# Altium schematic sheet Power.SchDoc
size A; SheetNumber: 3; SheetTotal: 3
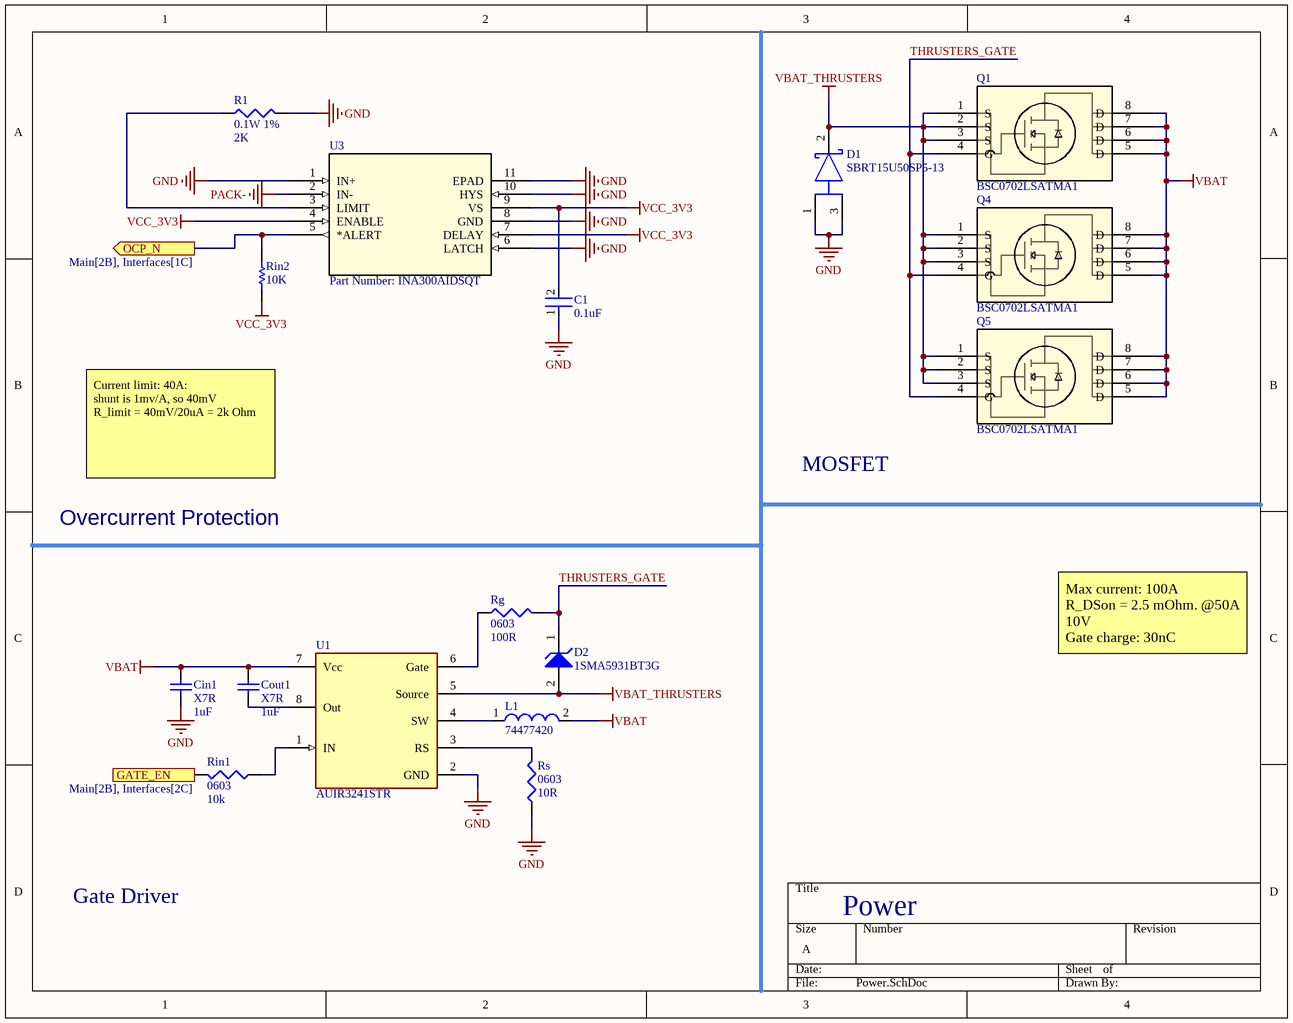
[diagram p0: Power.SchDoc]

## Parts
C1  0.1uF  [FP-C0603C-CF-MFG]
Cin1  X7R  value 1uF  [C0805]
Cout1  X7R  value 1uF  [C0805]
D1  SBRT15U50SP5-13  [FP-PowerDI5-MFG]
D2  1SMA5931BT3G  [ONSC-SMA-2-403D-02_F_V]
L1  74477420  [WE-PD2-M]
Q1  BSC0702LSATMA1  [PG-TDSON-8-7]
Q4  BSC0702LSATMA1  [PG-TDSON-8-7]
Q5  BSC0702LSATMA1  [PG-TDSON-8-7]
R1  0.1W 1%  value 2K  [J1-0603]
Rg  0603  value 100R  [J1-0603]
Rin1  0603  value 10k  [J1-0603]
Rin2  10K  [RESC0603(1608)_N]
Rs  0603  value 10R  [J1-0603]
U1  AUIR3241STR  [FP-PG-DSO-8-MFG]
U3  Part Number: INA300AIDSQT  [DSQ10_P9X1P5]

## Ports
GATE_EN (in, see Main[2B], Interfaces[2C]), OCP_N (out, see Main[2B], Interfaces[1C])

## Nets
GND: C1.1 Cin1.1 D1.1(A) D1.3(A) R1.2 Rs.1 U1.2(GND) U3.1(IN+) U3.6(LATCH) U3.8(GND) U3.10(HYS) U3.11(EPAD)
PACK-: U3.2(IN-)
VBAT: Cin1.2 Cout1.2 L1.2 Q1.5(D) Q1.6(D) Q1.7(D) Q1.8(D) Q4.5(D) Q4.6(D) Q4.7(D) Q4.8(D) Q5.5(D) Q5.6(D) Q5.7(D) Q5.8(D) U1.7(Vcc)
VBAT_THRUSTERS: D1.2(C) D2.2(A) Q1.1(S) Q1.2(S) Q1.3(S) Q4.1(S) Q4.2(S) Q4.3(S) Q5.1(S) Q5.2(S) Q5.3(S) U1.5(Source)
VCC_3V3: C1.2 Rin2.2 U3.4(ENABLE) U3.7(DELAY) U3.9(VS)
GATE_EN: Rin1.2 ; port GATE_EN
OCP_N: Rin2.1 U3.5(*ALERT) ; port OCP_N
THRUSTERS_GATE: D2.1(K) Q1.4(G) Q4.4(G) Q5.4(G) Rg.2
NetCout1_1: Cout1.1 U1.8(Out)
NetL1_1: L1.1 U1.4(SW)
NetR1_1: R1.1 U3.3(LIMIT)
NetRg_1: Rg.1 U1.6(Gate)
NetRin1_1: Rin1.1 U1.1(IN)
NetRs_2: Rs.2 U1.3(RS)

## Notes on the sheet
- Current limit: 40A:
  shunt is 1mv/A, so 40mV
  R_limit = 40mV/20uA = 2k Ohm
- MOSFET
- Overcurrent Protection
- Max current: 100A
  R_DSon = 2.5 mOhm. @50A 10V
  Gate charge: 30nC
- Gate Driver
- Power

## Library data of the parts
C1 = CMP-1035-02580-3: CAP CER 0.1UF 10V X7R 0603; Manufacturer Part Number: C0603C104K8RACTU; Manufacturer: KEMET; Tolerance: 0.1; Value: 0.10 μF; Material: Ceramic; Temperature Coefficient: 30ppm/°C; Automotive Grade: Grade 1; Digikey Description: CAP CER 0.1UF 10V X7R 0603; Temperature Range High: +125°C; RoHS: TRUE; ComponentLink2URL: https://api.kemet.com/component-edge/download/datasheet/C0603C100J5GACAUTO.pdf; Lead Free: Yes; Device Class L2: Capacitors; Mouser Description: Multilayer Ceramic Capacitors MLCC - SMD/SMT 10volts 0.1uF X7R 10%; Temperature: -55°C to +125°C; Category: Cap; Height: 0.87mm; Voltage Rating: 10 V; Device Class L3: Ceramic Capacitors; ComponentLink2Description: Datasheet; Automotive: Yes; Octopart: https://octopart.com/c0603c104k8ractu-kemet-145075; Temperature Characteristic: X7R; Device Class L1: Passive Components; Temperature Range Low: -55°C; Package: C0603C-CF; Capacitance: 0.10 μF
Cin1 Cout1 = Cap: Capacitor; Published: 8-Jun-2000; LatestRevisionDate: 17-Jul-2002; LatestRevisionNote: Re-released for DXP Platform.; PackageReference: RAD-0.3; Publisher: Altium Limited; PackageDescription: Radial Cap, Thru-Hole; 2 Leads; 0.3 in Pin Spacing
D1 = CMP-12791-000016-1: 50V 15A Rectifier Schottky Diode; Manufacturer: Diodes Inc.; Manufacturer Part Number: PDS3200-13; Standoff Height: 0mm; Forward Current: 3A; Reverse Voltage: 200V; Max Junction Temp: +150°C; Peak Reverse Current: 1uA; Max Surge Forward Current: 180A; RoHS: TRUE; ComponentLink2Description: Datasheet; Temperature: -65°C to +150°C; Category: Diode; Digikey Description: DIODE SCHOTTKY 200V 3A POWERDI5; Height: 1.15mm; Octopart: https://octopart.com/pds3200-13-diodes+inc.-332544; Device Class L1: Discrete Semiconductors; Mouser Description: PDS3200 Series 200 V 3 A High Voltage Schottky Barrier Rectifier - PowerDI-5; ComponentLink2URL: https://www.diodes.com/assets/Datasheets/ds30470.pdf; Temperature Range Low: -65°C; Lead Free: Yes; Max Repetitive Reverse Voltage: 200V; Device Class L2: Diodes; Footprint Url: https://www.diodes.com/assets/Package-Files/PowerDI5.pdf; Package: PowerDI5; Temperature Range High: +150°C; Automotive: No; Device Class L3: Rectifier Diodes
D2 = CMP-1060-00118-1: 1.5 W Zener Voltage Regulator, 2-Pin SMA, Pb-Free, Tape and Reel; Manufacturer: On Semiconductor; VZ Typ (V): 18; Mounting Technology: Surface Mount; RoHS: Pb-Free; PackageDescription: 2-Pin Small Molded Package, J-Bend Lead, Body 2.605 x 4.315 mm; ComponentLink2Description: Datasheet; DatasheetVersion: Rev. 8; ComponentLink2URL: http://www.onsemi.com/pub_link/Collateral/1SMA5913BT3-D.PDF; ComponentLink3URL: http://www.onsemi.com/pub_link/Collateral/1SMA5913BT3-D.PDF; ComponentLink1URL: http://www.onsemi.com/; ComponentLink1Description: Manufacturer URL; Packing: Tape and Reel; ComponentLink3Description: Package Specification; PackageVersion: Rev. F, 11/2008; PartNumber: 1SMA5931BT3G; PackageReference: SMA-2-403D-02_F
L1 = CMP-0227-00441-1: SMD Power Inductor WE-PD2, L = 100 µH; Inductance: 100 ÂµH; ComponentLink2Description: Datasheet; ComponentLink1URL: http://www.we-online.com; DatasheetVersion: ver 2, Jun-2005; ComponentLink2URL: http://www.we-online.de/katalog/media/pdf/74477420.pdf; PackageDescription: SMD Inductor, 2-Leads, Body 5.8 x 5.2 mm; PackageVersion: 2005; ComponentLink1Description: Manufacturer Link; PackageReference: WE-PD2-M
Q1 Q4 Q5 = BSC0702LSATMA1: No Description Available; Mfr_Name: Infineon; RefDes: RefDes; Type: Type
R1 = Res3: 2k 0.1W 1%; Published: 8-Jun-2000; LatestRevisionDate: 29-May-2009; LatestRevisionNote: IPC-7351 Footprint Added.; PackageReference: J1-0603; Publisher: Altium Limited; PackageDescription: Chip Resistor
Rg Rin1 Rs = Res3: Resistor; Published: 8-Jun-2000; LatestRevisionDate: 29-May-2009; LatestRevisionNote: IPC-7351 Footprint Added.; PackageReference: J1-0603; Publisher: Altium Limited; PackageDescription: Chip Resistor
Rin2 = CMP-1012-00098-1: 10K 0.1W 5% 0603 (1608 Metric)  SMD; Case-EIA: 0603; Value: 10000.00 Ohm; Case-Metric: 1608; Technology: SMT; Tolerance: 5 %; Power: 0.1 W
U1 = CMP-32851-000034-1: IC GATE DRVR HIGH-SIDE 8SO; Output Current: 300mA; Number of Drivers: 1; Mount: Surface Mount; Packaging: Cut Tape; RoHS Compliant: Yes; Lead Free: Lead Free; Max Operating Temperature: 150°C; Min Operating Temperature: -40°C; Halogen Free: Halogen Free; Number of Pins: 8; Case/Package: SOIC
U3 = INA300AIDSQT: No Description Available; Vendor: Texas Instruments; Built_By: EMA_UL_Team; Manufacturer_Part_Number: INA300AIDSQT; Copyright: Copyright (C) 2018 Accelerated Designs. All rights reserved; RefDes: RefDes; Type: DEV; Value: Value